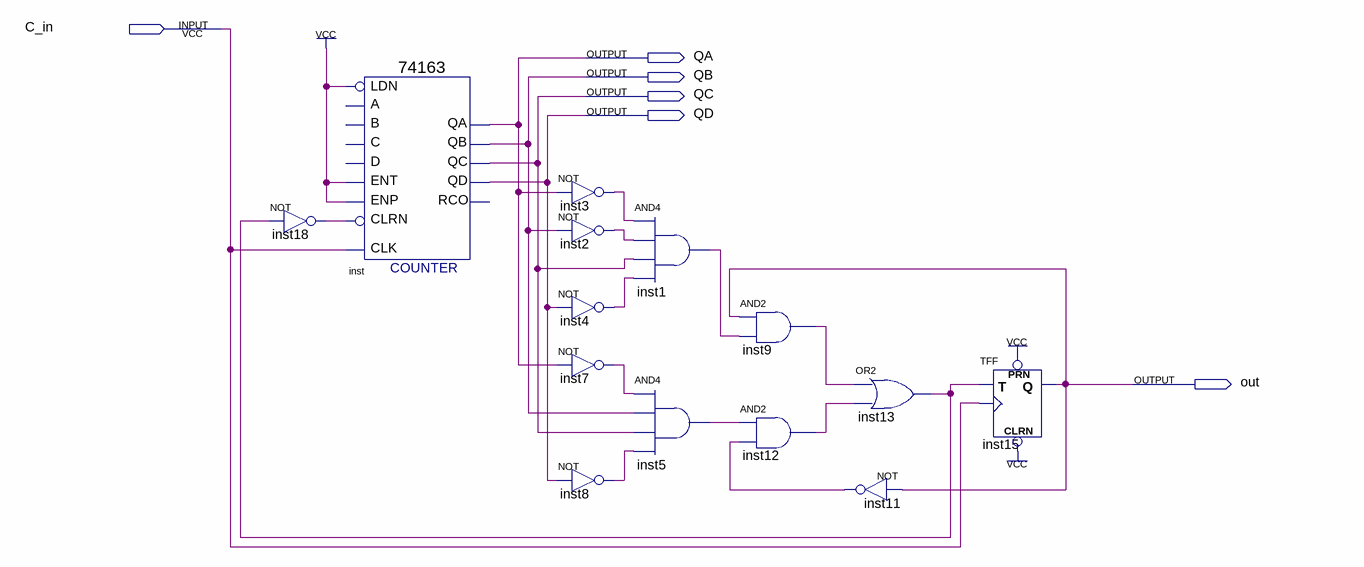
[diagram p0: schematic sheet]
// Quartus schematic Lab2.bdf as structural Verilog: 14 symbols, 6 pins
module Lab2 (
  input  C_in,
  output QA,
  output QB,
  output QC,
  output QD,
  output out
);

  wire inst1_out, inst2_out, inst3_out, inst4_out, inst5_out, inst7_out, inst8_out, inst9_out, inst11_out,
       inst12_out, inst13_out, inst18_out;

  not inst18 (inst18_out, inst13_out);
  \74163  inst (
    .ENT(1'b1), .CLRN(inst18_out), .CLK(C_in), .ENP(1'b1), .LDN(1'b1), .QA(QA), .QB(QB), .QC(QC), .QD(QD));  // open: C, B, A, D, RCO
  not inst3 (inst3_out, QA);
  not inst2 (inst2_out, QB);
  not inst4 (inst4_out, QD);
  not inst7 (inst7_out, QA);
  not inst8 (inst8_out, QD);
  and inst1 (inst1_out, inst3_out, inst2_out, QC, inst4_out);
  and inst5 (inst5_out, inst7_out, QB, QC, inst8_out);
  and inst9 (inst9_out, out, inst1_out);
  and inst12 (inst12_out, inst5_out, inst11_out);
  or inst13 (inst13_out, inst9_out, inst12_out);
  not inst11 (inst11_out, out);
  TFF inst15 (.PRN(1'b1), .CLRN(1'b1), .T(inst13_out), .CLK(C_in), .Q(out));
endmodule
